# EAGLE design Rev1.1 (EAGLE 7.2.0)
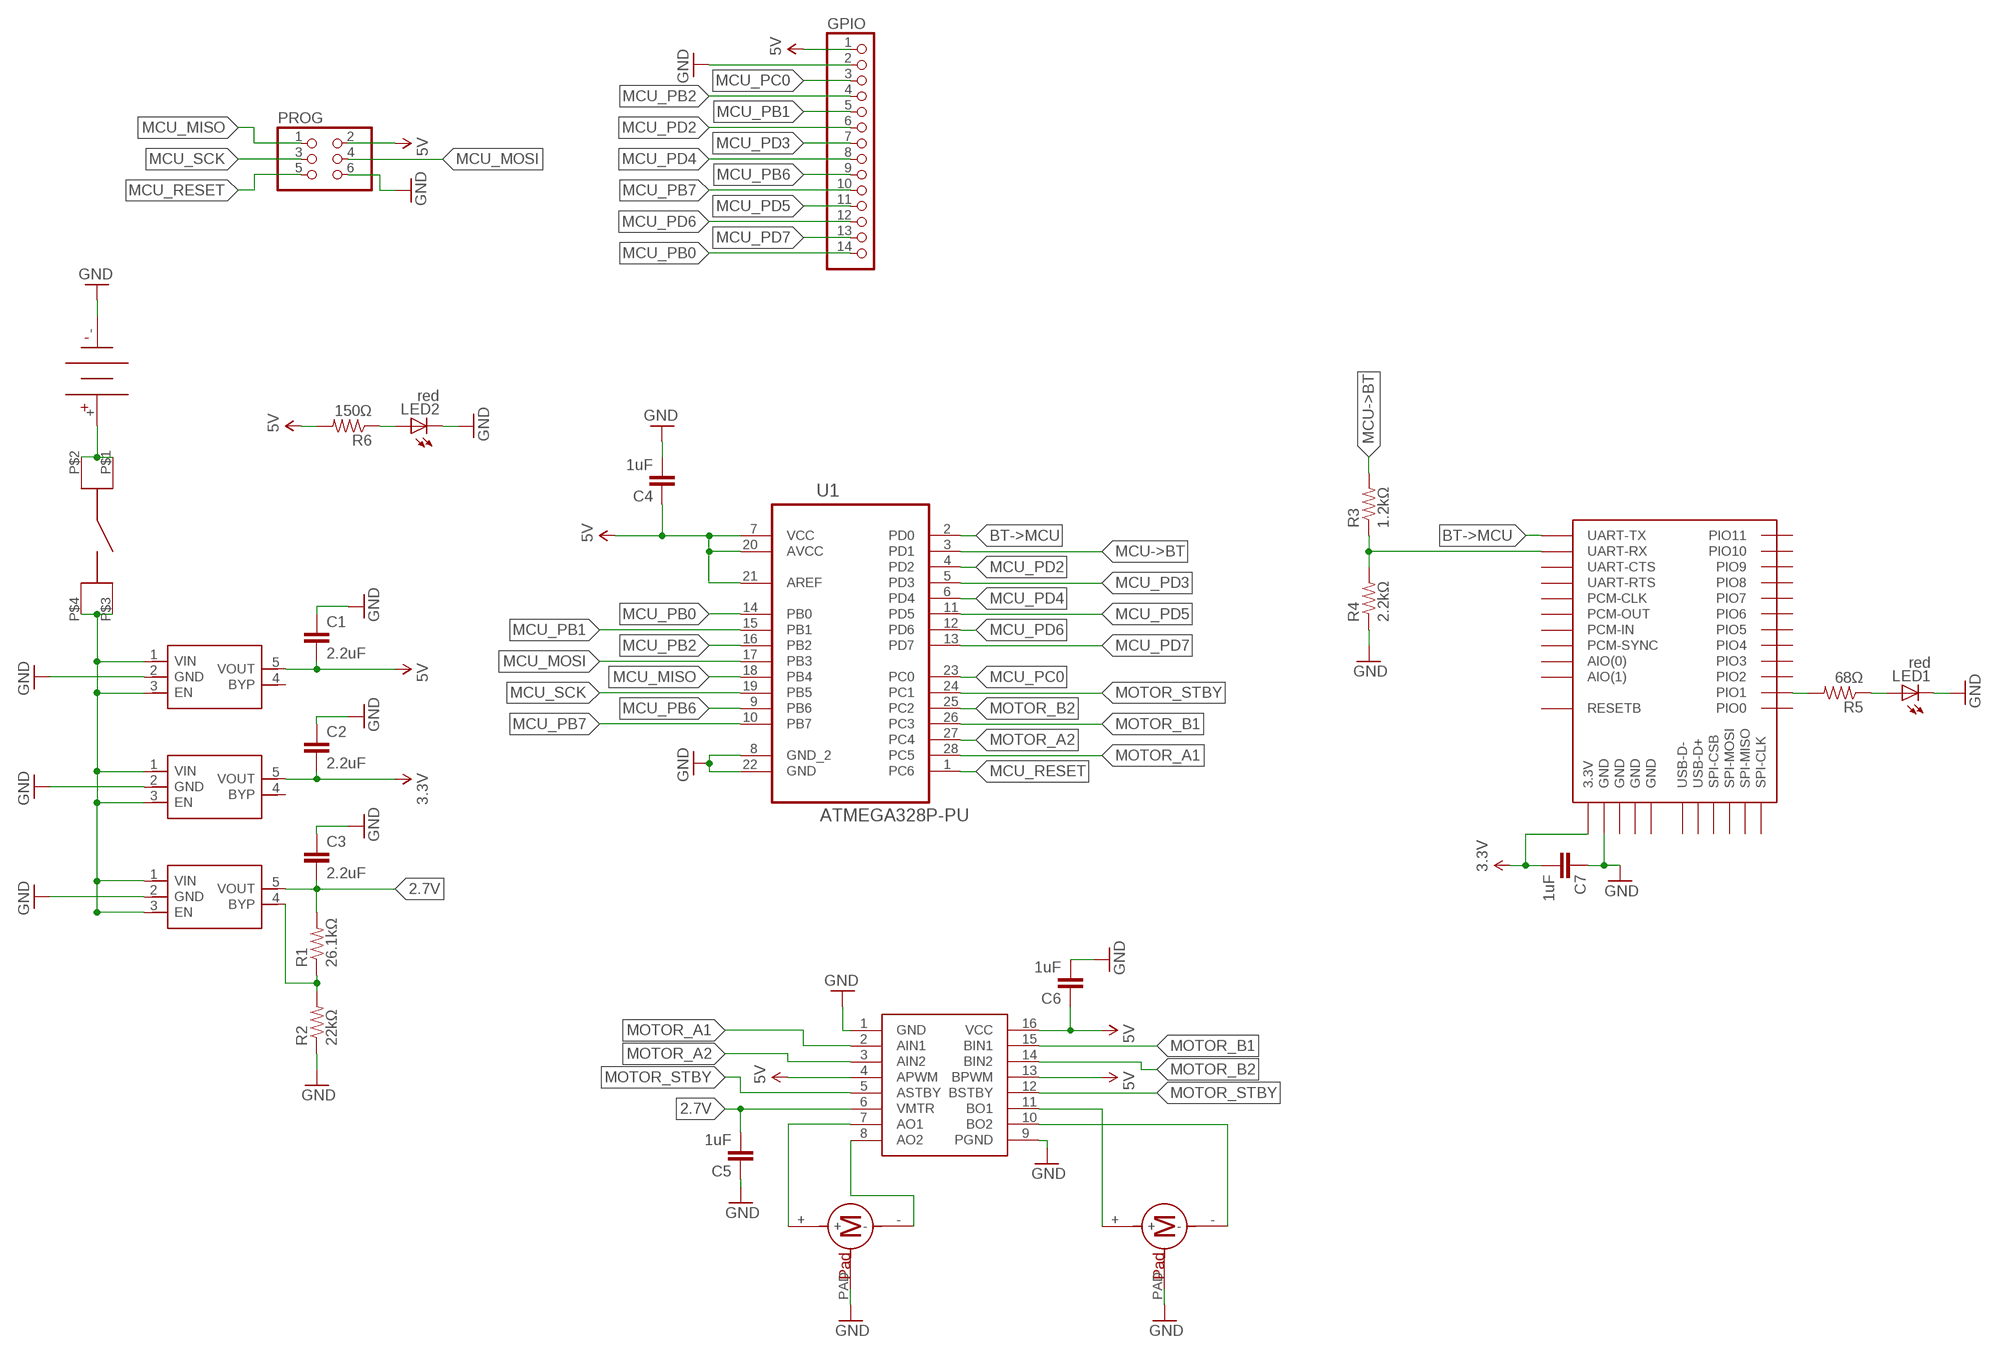
[diagram p0: schematic, sheet 1]

## Parts
C1  2.2uF  CAP0805  [0805]
C2  2.2uF  CAP0805  [0805]
C3  2.2uF  CAP0805  [0805]
C4  1uF  CAP0805  [0805]
C5  1uF  CAP0805  [0805]
C6  1uF  CAP0805  [0805]
C7  1uF  CAP0805  [0805]
GPIO  PINHD-1X14  [1X14]
LED1  red  LEDCHIP-LED0805  [CHIP-LED0805]
LED2  red  LEDCHIP-LED0805  [CHIP-LED0805]
PROG  PINHD-2X3  [2X03]
R1  26.1kΩ  RESISTOR0805-RES  [0805]
R2  22kΩ  RESISTOR0805-RES  [0805]
R3  1.2kΩ  RESISTOR0805-RES  [0805]
R4  2.2kΩ  RESISTOR0805-RES  [0805]
R5  68Ω  RESISTOR0805-RES  [0805]
R6  150Ω  RESISTOR0805-RES  [0805]
U1  ATMEGA328P-PU  [DIP254P762X457-28]
U2  BT  BTM400_6B  [BTM400_6B]
U3  SMD_H-BRIDGE  [SSOP16]
U$1  20MM_COIN  [20MM_COIN]
U$2  POWER_BTN  [POWER_BTN]
U$3  5V Reg  SPX3819  [SOT23-5]
U$4  3.3V Reg  SPX3819  [SOT23-5]
U$5  2.7V Reg  SPX3819  [SOT23-5]
U$7  PICO_VIBE_MTR  [PICO_VIBE_MTR]
U$8  PICO_VIBE_MTR  [PICO_VIBE_MTR]

## Nets
2.7V [Power]: C3.2 C5.2 R1.2 U3.6(VMTR) U$5.5(VOUT)
3.3V [Power]: C2.2 C7.2 U2.3.3V U$4.5(VOUT)
5V [Power]: C1.2 C4.1 C6.1 GPIO.1 PROG.2 R6.2 U1.7(VCC) U1.20(AVCC) U1.21(AREF) U3.4(APWM) U3.13(BPWM) U3.16(VCC) U$3.5(VOUT)
BT->MCU: U1.2(PD0) U2.UART-TX
GND [Power]: C1.1 C2.1 C3.1 C4.2 C5.1 C6.2 C7.1 GPIO.2 LED1.C LED2.C PROG.6 R2.1 R4.1 U1.8(GND_2) U1.22(GND) U2.GND@1(GND) U3.1(GND) U3.9(PGND) U$1.- U$3.2(GND) U$4.2(GND) U$5.2(GND) U$7.PAD U$8.PAD
MCU->BT: R3.2 U1.3(PD1)
MCU_MISO: PROG.1 U1.18(PB4)
MCU_MOSI: PROG.4 U1.17(PB3)
MCU_PB0: GPIO.14 U1.14(PB0)
MCU_PB1: GPIO.5 U1.15(PB1)
MCU_PB2: GPIO.4 U1.16(PB2)
MCU_PB6: GPIO.9 U1.9(PB6)
MCU_PB7: GPIO.10 U1.10(PB7)
MCU_PC0: GPIO.3 U1.23(PC0)
MCU_PD2: GPIO.6 U1.4(PD2)
MCU_PD3: GPIO.7 U1.5(PD3)
MCU_PD4: GPIO.8 U1.6(PD4)
MCU_PD5: GPIO.11 U1.11(PD5)
MCU_PD6: GPIO.12 U1.12(PD6)
MCU_PD7: GPIO.13 U1.13(PD7)
MCU_RESET: PROG.5 U1.1(PC6)
MCU_SCK: PROG.3 U1.19(PB5)
MOTOR_A1: U1.28(PC5) U3.2(AIN1)
MOTOR_A2: U1.27(PC4) U3.3(AIN2)
MOTOR_B1: U1.26(PC3) U3.15(BIN1)
MOTOR_B2: U1.25(PC2) U3.14(BIN2)
MOTOR_STBY: U1.24(PC1) U3.5(ASTBY) U3.12(BSTBY)
N$1 [Power]: U$1.+ U$2.P$1 U$2.P$2
N$2 [Power]: U$2.P$3 U$2.P$4 U$3.1(VIN) U$3.3(EN) U$4.1(VIN) U$4.3(EN) U$5.1(VIN) U$5.3(EN)
N$3 [Power]: R1.1 R2.2 U$5.4(BYP)
N$4: U3.7(AO1) U$7.+
N$5: U3.8(AO2) U$7.-
N$6: U3.11(BO1) U$8.+
N$7: U3.10(BO2) U$8.-
N$9: R3.1 R4.2 U2.UART-RX
N$10: R5.2 U2.PIO(1)(PIO1)
N$11: LED1.A R5.1
N$12: LED2.A R6.1
Unconnected: U2.AIO(0) U2.AIO(1) U2.PCM-CLK U2.PCM-IN U2.PCM-OUT U2.PCM-SYNC U2.PIO(0)(PIO0) U2.PIO(2)(PIO2) U2.PIO(3)(PIO3) U2.PIO(4)(PIO4) U2.PIO(5)(PIO5) U2.PIO(6)(PIO6) U2.PIO(7)(PIO7) U2.PIO(8)(PIO8) U2.PIO(9)(PIO9) U2.PIO(10)(PIO10) U2.PIO(11)(PIO11) U2.RESETB U2.SPI-CLK U2.SPI-CSB U2.SPI-MISO U2.SPI-MOSI U2.UART-CTS U2.UART-RTS U2.USB-D+ U2.USB-D- U$3.4(BYP) U$4.4(BYP)

## Power pins joined to a net without a drawn wire
GND: U2.GND@2(GND) U2.GND@3(GND) U2.GND@4(GND)

## Library data of the parts
C1-C7 = SparkFun-Capacitors:CAP: Capacitor Standard 0603 ceramic capacitor, and 0.1" leaded capacitor.
GPIO = pinhead:PINHD-1X14: PIN HEADER
LED1 LED2 = adafruit:LED: LED OSRAM: - CHIPLED LG R971, LG N971, LY N971, LG Q971, LY Q971, LO R971, LY R971 LH N974, LH R974 LS Q976, LO Q976, LY Q976 LO Q996 - Hyper CHIPLED LW Q18S LB Q993, LB Q99A, LB R99A - SideLED LS A670, LO A670, LY A670, LG A670, LP A670 LB A673, LV A673, LT A673, LW A673 LH A674 LY A675 LS A676, LA A676, LO A676, LY A676, LW A676 LS A679, LY A679, LG A679 - Hyper Micro SIDELED® LS Y876, LA Y876, LO Y876, LY Y876 LT Y87S - SmartLED LW L88C, LW L88S LB L89C, LB L89S, LG L890 LS L89K, LO L89K, LY L89K LS L896, LA L896, LO L896, LY L896 - TOPLED LS T670, LO T670, LY T670, LG T670, LP T670 LSG T670, LSP T670, LSY T670, LOP T670, LYG T670 LG T671, LOG T671, LSG T671 LB T673, LV T673, LT T673, LW T673 LH T674 LS T676, LA T676, LO T676, LY T676, LB T676, LH T676, LSB T676, LW T676 LB T67C, LV T67C, LT T67C, LS T67K, LO T67K, LY T67K, LW E67C LS E67B, LA E67B, LO E67B, LY E67B, LB E67C, LV E67C, LT E67C LW T67C LS T679, LY T679, LG T679 LS T770, LO T770, LY T770, LG T770, LP T770 LB T773, LV T773, LT T773, LW T773 LH T774 LS E675, LA E675, LY E675, LS T675 LS T776, LA T776, LO T776, LY T776, LB T776 LHGB T686 LT T68C, LB T68C - Hyper Mini TOPLED® LB M676 - Mini TOPLED Santana® LG M470 LS M47K, LO M47K, LY M47K Source: http://www.osram.convergy.de/
PROG = pinhead:PINHD-2X3: PIN HEADER
R1-R6 = SparkFun-Resistors:RESISTOR: Resistor Basic schematic elements and footprints for 0603, 1206, and PTH resistors.
U1 = Atmel_By_element14_Batch_1-00:ATMEGA328P-PU: 8-bit Microcontroller with In-System Programmable Flash; MPN: ATMEGA328P-PU; OC_FARNELL: 1715487; OC_NEWARK: 15R0268; PACKAGE: PDIP-28; SUPPLIER: Atmel
U2 = BayouBot:BTM400_6B: Bluetooth Chip DealExtreme SKU 80711 bluetooth trasnceiver.
U3 = BayouBot:SMD_H-BRIDGE: An SMD H Bridge motor driver. http://www.digikey.com/product-detail/en/TB6552FNG,8,EL/TB6552FNG8ELCT-ND/1730120
U$1 = BayouBot:20MM_COIN: 20mm Coin Cell Battery Holder A 20mm coin cell stack holder from: http://www.digikey.com/product-detail/en/BH800S/BH800S-ND/221549
U$2 = BayouBot:POWER_BTN: SPST Power Button See http://www.mouser.com/ProductDetail/TE-Connectivity/1571634-2/?qs=%2fha2pyFadui2HzHiT1GcjLJGX5s1RLrmiOtkOC0QRmbWcn%2fKgC%252bE3Q%3d%3d
U$3-U$5 = BayouBot:SPX3819: SPX3819 SMD linear volate regulator. Part was made for the following components: (5V reg) SPX3819M5-L-5-0/TR (3.3V reg) SPX3819M5-L-3-3/TR (Adjustable reg) SPX3819M5-L/TR
U$7 U$8 = BayouBot:PICO_VIBE_MTR: Pico Vibe Vibration Motor A sufrace mounted vibration motor. https://catalog.precisionmicrodrives.com/order-parts/product/304-103-4mm-vibration-motor-6mm-type

## Net classes
1 Power: width 0.305 mm, clearance 0.152 mm

## Board
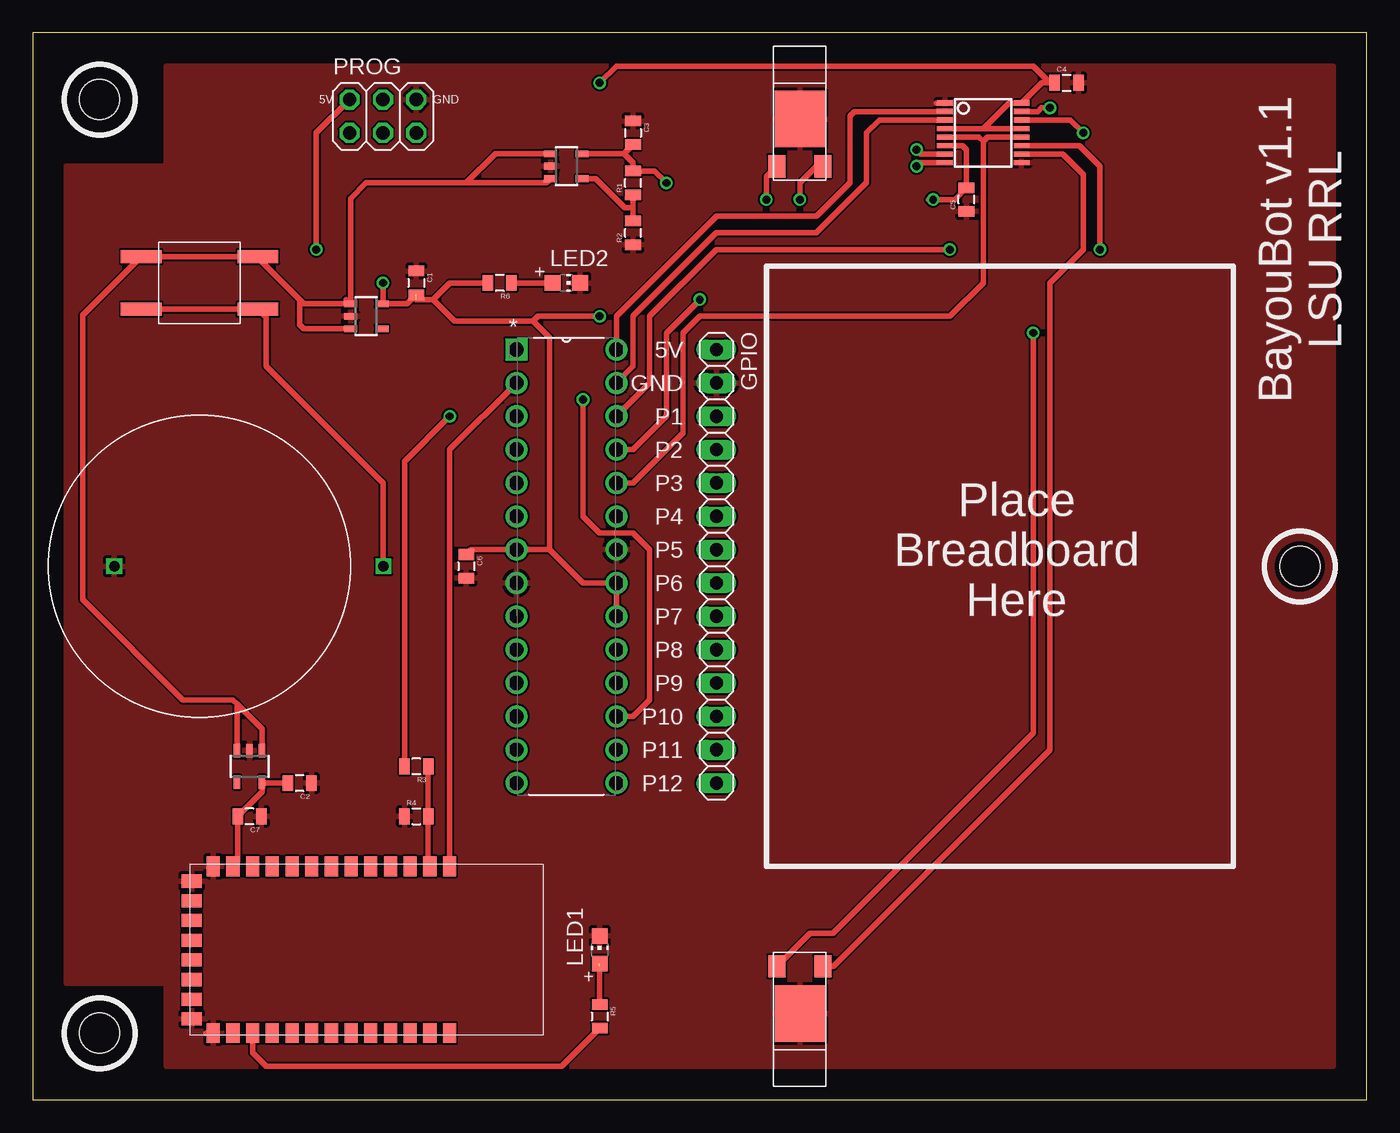
[diagram p1: board, top side]
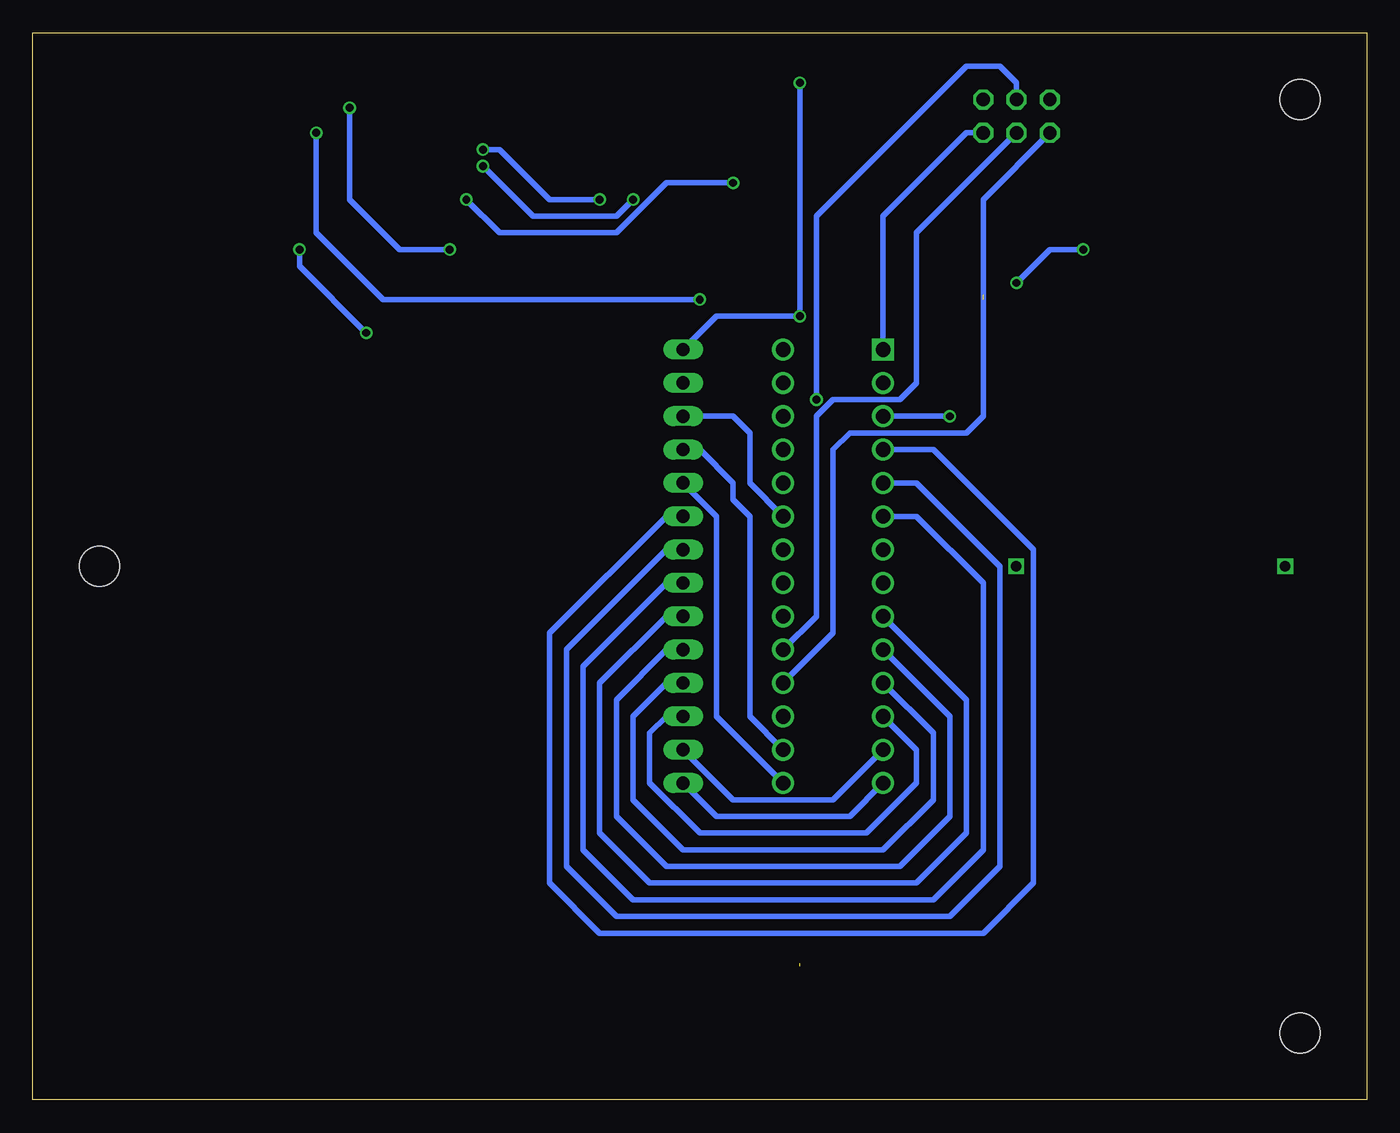
[diagram p2: board, bottom side, seen from below]

Size 101.6 x 81.28 mm. Coordinates in mm from the lower left corner, seen from the top.
Outline: 0,0 101.6,0 101.6,81.28 0,81.28 0,0
Copper layers (1*16): Top 0.0356mm / dielectric 1.5011mm / Bottom 0.0356mm
Design rules "LaenPCBOrder": minimum track width 6mil, minimum drill 13mil, track to track 6mil, track to pad 6mil, pad to pad 6mil, via to via 6mil, smd to smd 6mil, copper to edge 15mil, drill to drill 6mil, minimum pad ring 7mil, minimum via ring 7mil, stop-mask expansion 3mil, vias tented up to drill 0mil, thermal gap 10mil
Holes 3.05 mm at 5.08,5.08 5.08,76.2 96.52,40.64

### Footprints (pad centres in the part's own frame; a part is rotated, then mirrored left to right if it is on the bottom)
0805 = smd 0.8 x 1.2: 1 -0.9,0; 2 0.9,0
1X14 = drill 1.016 long: 1 -16.51,0; 2 -13.97,0; 3 -11.43,0; 4 -8.89,0; 5 -6.35,0; 6 -3.81,0; 7 -1.27,0; 8 1.27,0; 9 3.81,0; 10 6.35,0; 11 8.89,0; 12 11.43,0; 13 13.97,0; 14 16.51,0
CHIP-LED0805 = smd 1.2 x 1.2: A 0,-1.05; C 0,1.05
2X03 = drill 1.016 octagon: 1 -2.54,-1.27; 2 -2.54,1.27; 3 0,-1.27; 4 0,1.27; 5 2.54,-1.27; 6 2.54,1.27
DIP254P762X457-28 = drill 1.118 square: 1 -7.62,33.02 | drill 1.118: 2 -7.62,30.48; 3 -7.62,27.94; 4 -7.62,25.4; 5 -7.62,22.86; 6 -7.62,20.32; 7 -7.62,17.78; 8 -7.62,15.24; 9 -7.62,12.7; 10 -7.62,10.16; 11 -7.62,7.62; 12 -7.62,5.08; 13 -7.62,2.54; 14 -7.62,0; 15 0,0; 16 0,2.54; 17 0,5.08; 18 0,7.62; 19 0,10.16; 20 0,12.7; 21 0,15.24; 22 0,17.78; 23 0,20.32; 24 0,22.86; 25 0,25.4; 26 0,27.94; 27 0,30.48; 28 0,33.02
BTM400_6B = smd 1.5 x 1: 3.3V -6.35,-10.16; AIO(0) -6.35,-5.66; AIO(1) -6.35,-7.16; GND@1 -6.35,-11.66; GND@4 6.35,-11.66; PCM-CLK -6.35,0.34; PCM-IN -6.35,-2.66; PCM-OUT -6.35,-1.16; PCM-SYNC -6.35,-4.16; PIO(0) 6.35,-10.16; PIO(1) 6.35,-8.66; PIO(2) 6.35,-7.16; PIO(3) 6.35,-5.66; PIO(4) 6.35,-4.16; PIO(5) 6.35,-2.66; PIO(6) 6.35,-1.16; PIO(7) 6.35,0.34; PIO(8) 6.35,1.84; PIO(9) 6.35,3.34; PIO(10) 6.35,4.84; PIO(11) 6.35,6.34; RESETB -6.35,-8.66; UART-CTS -6.35,3.34; UART-RTS -6.35,1.84; UART-RX -6.35,4.84; UART-TX -6.35,6.34 | smd 1 x 1.5: GND@2 -5.23,-13.3; GND@3 5.27,-13.3; SPI-CLK 2.27,-13.3; SPI-CSB -2.23,-13.3; SPI-MISO 0.77,-13.3; SPI-MOSI -0.73,-13.3; USB-D+ 3.77,-13.3; USB-D- -3.73,-13.3
SSOP16 = smd 0.4 x 1.2: 1 -2.275,-2.925; 2 -1.625,-2.925; 3 -0.975,-2.925; 4 -0.325,-2.925; 5 0.325,-2.925; 6 0.975,-2.925; 7 1.625,-2.925; 8 2.275,-2.925; 9 2.275,2.925; 10 1.625,2.925; 11 0.975,2.925; 12 0.325,2.925; 13 -0.325,2.925; 14 -0.975,2.925; 15 -1.625,2.925; 16 -2.275,2.925
20MM_COIN = drill 0.8 square: + 0,-14; - 0,6.5
POWER_BTN = smd 3.1 x 1: P$1 -4.45,2; P$2 4.45,2; P$3 -4.45,-2; P$4 4.45,-2
SOT23-5 = smd 0.5 x 1: 1 -0.95,-1.2; 2 0,-1.2; 3 0.95,-1.2; 4 0.95,1.2; 5 -0.95,1.2
PICO_VIBE_MTR = smd 1.3 x 1.7: + -1.75,2.55; - 1.75,2.55 | smd 3.8 x 4.3: PAD 0,-1.05

### Placement (x,y rotation side)
C1  29.21,62.23 270 top
C2  20.32,24.13 180 top
C3  45.72,73.66 270 top
C4  78.74,77.47 0 top
C5  71.12,68.58 90 top
C6  33.02,40.64 270 top
C7  16.51,21.59 180 top
GPIO  52.07,40.64 270 top
LED1  43.18,11.43 0 top
LED2  40.64,62.23 270 top
PROG  26.67,74.93 0 top
R1  45.72,69.85 90 top
R2  45.72,66.04 90 top
R3  29.21,25.4 180 top
R4  29.21,21.59 0 top
R5  43.18,6.35 270 top
R6  35.56,62.23 180 top
U1  44.45,24.13 0 top
U2  25.4,11.43 270 top
U3  72.39,73.66 270 top
U$1  12.7,40.64 90 top
U$2  12.7,62.23 180 top
U$3  25.4,59.69 270 top
U$4  16.51,25.4 180 top
U$5  40.64,71.12 270 top
U$7  58.42,73.66 180 top
U$8  58.42,7.62 0 top

### Tracks (layer width: path | path; a pad name or v marks a point on that pad's centre or on a via)
2.7V  (via drill 0.6 pad 0.61)
  Top 0.406: U$5.5 45.03,72.07 | 45.03,72.07 C3.2 | 45.03,72.07 45.72,71.38 R1.2 47.36,70.75 v48.26,69.85 | U3.6 70.83,72.69 71.12,72.39 C5.2 70.22,68.58 v68.58,68.58 68.21,68.58
  Bottom 0.406: v48.26,69.85 53.34,69.85 57.15,66.04 66.04,66.04 v68.58,68.58
3.3V
  Top 0.406: C2.2 17.46,24.13 U$4.5 17.46,23.44 C7.2 15.61,18.15 U2.3.3V
5V  (via drill 0.6 pad 0.61)  (1 unrouted)
  Top 0.406: 39.37,41.91 41.91,39.37 U1.21 U1.20 | C1.2 28.52,60.64 U$3.5 26.67,60.71 v26.67,62.23 | 38.1,59.32 32.12,59.32 30.48,60.96 | 39.37,41.91 U1.7 33.39,41.91 C6.1 | 39.37,41.91 39.37,58.05 38.1,59.32 | 30.48,60.96 29.21,60.96 | v43.18,59.69 38.47,59.69 38.1,59.32 | R6.2 31.75,62.23 30.48,60.96 | PROG.2 21.59,73.66 v21.59,64.77 | U3.4 72.39,73.98 | 72.39,73.98 U3.13 | 72.39,73.98 74.34,75.94 U3.16 76.85,77.47 77.47,77.47 | C4.1 77.47,77.47 | 77.47,77.47 76.2,78.74 44.45,78.74 v43.18,77.47
  Bottom 0.406: GPIO.1 49.53,59.69 v43.18,59.69 v43.18,77.47 | v21.59,64.77 24.13,64.77 v26.67,62.23
BT->MCU
  Top 0.406: U2.UART-TX 31.74,49.52 U1.2
GND
  Top 0.406: R2.1 45.72,64.99 | U2.GND@4 13.18,5.08 | U3.1 68.84,75.94
  pour Top: 2.54,71.12 10.16,71.12 10.16,78.74 99.06,78.74 99.06,2.54 10.16,2.54 10.16,8.89 2.54,8.89
MCU->BT  (via drill 0.6 pad 0.61)
  Top 0.406: R3.2 28.31,48.63 v31.75,52.07
  Bottom 0.406: v31.75,52.07 U1.3
MCU_MISO
  Bottom 0.406: U1.18 40.64,35.56 40.64,49.53 39.37,50.8 30.48,50.8 29.21,52.07 29.21,68.58 PROG.1
MCU_MOSI  (via drill 0.6 pad 0.61)
  Top 0.406: U1.17 45.72,29.21 46.99,30.48 46.99,41.91 45.72,43.18 43.18,43.18 41.91,44.45 v41.91,53.34
  Bottom 0.406: v41.91,53.34 41.91,67.31 30.48,78.74 27.94,78.74 26.67,77.47 PROG.4
MCU_PB0
  Bottom 0.406: U1.14 39.37,21.59 49.53,21.59 GPIO.14
MCU_PB1
  Bottom 0.406: U1.15 49.53,29.21 49.53,44.45 GPIO.5
MCU_PB2
  Bottom 0.406: U1.16 46.99,29.21 46.99,44.45 48.26,45.72 48.26,46.99 50.8,49.53 GPIO.4
MCU_PB6
  Bottom 0.406: U1.9 30.48,30.48 30.48,20.32 34.29,16.51 54.61,16.51 58.42,20.32 58.42,31.75 53.34,36.83 GPIO.9
MCU_PB7
  Bottom 0.406: U1.10 31.75,29.21 31.75,21.59 35.56,17.78 53.34,17.78 57.15,21.59 57.15,30.48 53.34,34.29 GPIO.10
MCU_PC0
  Bottom 0.406: U1.23 46.99,46.99 46.99,50.8 48.26,52.07 GPIO.3
MCU_PD2
  Bottom 0.406: U1.4 33.02,49.53 25.4,41.91 25.4,16.51 29.21,12.7 58.42,12.7 62.23,16.51 62.23,35.56 53.34,44.45 GPIO.6
MCU_PD3
  Bottom 0.406: U1.5 34.29,46.99 27.94,40.64 27.94,17.78 31.75,13.97 57.15,13.97 60.96,17.78 60.96,34.29 53.34,41.91 GPIO.7
MCU_PD4
  Bottom 0.406: U1.6 34.29,44.45 29.21,39.37 29.21,19.05 33.02,15.24 55.88,15.24 59.69,19.05 59.69,33.02 53.34,39.37 GPIO.8
MCU_PD5
  Bottom 0.406: U1.11 33.02,27.94 33.02,22.86 36.83,19.05 52.07,19.05 55.88,22.86 55.88,29.21 53.34,31.75 GPIO.11
MCU_PD6
  Bottom 0.406: U1.12 34.29,26.67 34.29,24.13 38.1,20.32 50.8,20.32 54.61,24.13 54.61,27.94 53.34,29.21 GPIO.12
MCU_PD7
  Bottom 0.406: U1.13 40.64,22.86 48.26,22.86 GPIO.13
MCU_RESET
  Bottom 0.406: U1.1 36.83,67.31 30.48,73.66 PROG.5
MCU_SCK
  Bottom 0.406: PROG.3 34.29,66.04 34.29,54.61 35.56,53.34 40.64,53.34 41.91,52.07 41.91,36.83 U1.19
MOTOR_A1
  Top 0.406: U1.28 44.45,59.69 52.07,67.31 59.69,67.31 62.23,69.85 62.23,74.93 62.59,75.28 U3.2
MOTOR_A2
  Top 0.406: U3.3 64.47,74.64 63.5,73.66 63.5,69.85 59.69,66.04 52.07,66.04 45.72,59.69 45.72,55.88 U1.27
MOTOR_B1  (via drill 0.6 pad 0.61)
  Top 0.406: U1.26 46.99,54.61 46.99,59.69 52.07,64.77 v69.85,64.77 | v77.47,75.56 76.83,75.56 76.56,75.28 U3.15
  Bottom 0.406: v69.85,64.77 73.66,64.77 77.47,68.58 v77.47,75.56
MOTOR_B2  (via drill 0.6 pad 0.61)
  Top 0.406: U1.25 45.72,49.53 48.26,52.07 48.26,58.42 v50.8,60.96 | U3.14 79.03,74.64 v80.01,73.66
  Bottom 0.406: v50.8,60.96 74.93,60.96 80.01,66.04 v80.01,73.66
MOTOR_STBY
  Top 0.406: U1.24 45.72,46.99 49.53,50.8 49.53,58.42 50.8,59.69 69.85,59.69 72.39,62.23 72.39,73.03 | U3.5 72.08,73.33 72.39,73.03 | U3.12 72.7,73.33 72.39,73.03
N$1
  Top 0.406: U$1.+ 26.67,40.64 26.67,46.99 17.78,55.88 17.78,59.6 U$2.P$1 U$2.P$2
N$2
  Top 0.406: 24.2,60.96 24.13,60.96 24.13,60.64 | 24.2,60.96 U$3.1 | U$3.1 24.13,60.64 | 24.2,60.96 24.2,68.65 25.4,69.85 33.02,69.85 | 33.02,69.85 39.12,69.85 U$5.3 | U$5.1 35.24,72.07 33.02,69.85 | 23.88,60.96 U$3.1 | 20.32,60.96 17.15,64.13 U$2.P$3 U$2.P$4 3.81,59.79 3.81,38.1 11.43,30.48 15.24,30.48 15.56,30.16 | 20.32,60.96 20.32,59.05 20.64,58.74 U$3.3 | 24.13,60.64 20.64,60.64 20.32,60.96 | U$4.3 15.56,30.16 | U$4.1 17.46,28.26 15.56,30.16
N$3
  Top 0.406: R1.1 45.72,67.94 | 45.72,67.94 R2.2 | U$5.4 42.86,70.17 45.09,67.94 45.72,67.94
N$4  (via drill 0.6 pad 0.61)
  Top 0.406: U3.7 67.67,72.03 v67.31,72.39 | v58.42,68.58 58.42,69.85 59.69,71.12 U$7.+
  Bottom 0.406: v67.31,72.39 66.04,72.39 62.23,68.58 v58.42,68.58
N$5  (via drill 0.6 pad 0.61)
  Top 0.406: U3.8 67.58,71.39 v67.31,71.12 | v55.88,68.58 55.88,70.32 U$7.-
  Bottom 0.406: v67.31,71.12 63.5,67.31 57.15,67.31 v55.88,68.58
N$6  (via drill 0.6 pad 0.61)
  Top 0.406: U3.11 79.72,72.69 81.28,71.12 v81.28,64.77 | v76.2,58.42 76.2,27.94 60.96,12.7 59.2,12.7 U$8.+
  Bottom 0.406: v81.28,64.77 81.28,63.5 v76.2,58.42
N$7
  Top 0.406: U$8.- 60.97,10.17 77.47,26.67 77.47,62.23 80.01,64.77 80.01,70.48 78.46,72.03 U3.10
N$9
  Top 0.406: R3.1 R4.2 30.11,17.91 U2.UART-RX
N$10
  Top 0.406: U2.PIO(1) 16.74,3.58 17.78,2.54 40.27,2.54 R5.2
N$11  (1 unrouted)
  Top 0.406: R5.1 43.18,10.16
N$12
  Top 0.406: R6.1 LED2.A

### Text on the board
tNames: 5V | GND | BayouBot v1.1 / LSU RRL | 5V | GND | P1 | P2 | P3 | P4 | P5 | Place / Breadboard / Here | P6 | P7 | P8 | P9 | P10 | P11 | P12